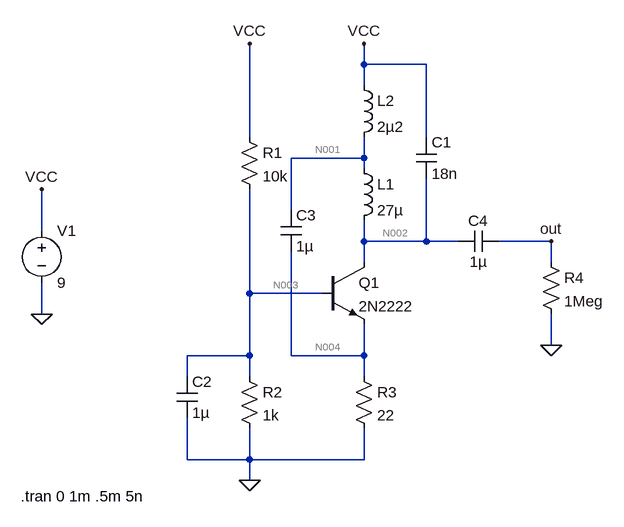
[diagram p0: schematic Perc-5-Hartley.asc]
Perc-5-Hartley.asc, the LTspice schematic file:
Version 4
SHEET 1 880 680
WIRE 288 -112 288 -144
WIRE 384 -112 288 -112
WIRE 288 -80 288 -112
WIRE 112 0 112 -144
WIRE 384 0 384 -112
WIRE 288 32 288 0
WIRE 288 32 176 32
WIRE 288 48 288 32
WIRE 176 112 176 32
WIRE -208 144 -208 80
WIRE 288 160 288 128
WIRE 384 160 384 64
WIRE 384 160 288 160
WIRE 432 160 384 160
WIRE 576 160 496 160
WIRE 288 192 288 160
WIRE 576 192 576 160
WIRE 112 240 112 80
WIRE 224 240 112 240
WIRE -208 272 -208 224
WIRE 576 320 576 272
WIRE 112 336 112 240
WIRE 112 336 16 336
WIRE 176 336 176 176
WIRE 288 336 288 288
WIRE 288 336 176 336
WIRE 16 368 16 336
WIRE 112 368 112 336
WIRE 288 368 288 336
WIRE 16 496 16 432
WIRE 112 496 112 448
WIRE 112 496 16 496
WIRE 288 496 288 448
WIRE 288 496 112 496
WIRE 112 528 112 496
FLAG -208 272 0
FLAG -208 80 VCC
FLAG 112 -144 VCC
FLAG 288 -144 VCC
FLAG 112 528 0
FLAG 576 320 0
FLAG 576 160 out
SYMBOL npn 224 192 R0
SYMATTR InstName Q1
SYMATTR Value 2N2222
SYMBOL res 96 -16 R0
SYMATTR InstName R1
SYMATTR Value 10k
SYMBOL res 96 352 R0
SYMATTR InstName R2
SYMATTR Value 1k
SYMBOL ind 272 32 R0
SYMATTR InstName L1
SYMATTR Value 27µ
SYMBOL ind 272 -96 R0
SYMATTR InstName L2
SYMATTR Value 2µ2
SYMBOL cap 368 0 R0
SYMATTR InstName C1
SYMATTR Value 18n
SYMBOL res 272 352 R0
SYMATTR InstName R3
SYMATTR Value 22
SYMBOL cap 0 368 R0
SYMATTR InstName C2
SYMATTR Value 1µ
SYMBOL cap 160 112 R0
SYMATTR InstName C3
SYMATTR Value 1µ
SYMBOL voltage -208 128 R0
SYMATTR InstName V1
SYMATTR Value 9
SYMBOL cap 496 144 R90
WINDOW 0 0 32 VBottom 2
WINDOW 3 32 32 VTop 2
SYMATTR InstName C4
SYMATTR Value 1µ
SYMBOL res 560 176 R0
SYMATTR InstName R4
SYMATTR Value 1Meg
TEXT -240 552 Left 2 !.tran 0 1m .5m 5n

The netlist it stands for:
* Perc-5-Hartley.asc
Q1 N002 N003 N004 0 2N2222
R1 VCC N003 10k
R2 N003 0 1k
L1 N001 N002 27µ
L2 VCC N001 2µ2
C1 VCC N002 18n
R3 N004 0 22
C2 N003 0 1µ
C3 N001 N004 1µ
V1 VCC 0 9
C4 out N002 1µ
R4 out 0 1Meg
.model NPN NPN
.model PNP PNP
.lib standard.bjt
.tran 0 1m .5m 5n
.backanno
.end

* Results of the author's LTspice run, read from the files saved beside the schematic
* Operating Point, zero values left out:
*   V(n002) = 9 V
*   V(n003) = 798.2 mV
*   V(n004) = 103.6 mV
*   V(vcc) = 9 V
*   V(n001) = 9 V
*   Ic(Q1) = 4.688 mA
*   Ib(Q1) = 21.98 µA
*   Ie(Q1) = -4.71 mA
*   I(L2) = 4.688 mA
*   I(L1) = 4.688 mA
*   I(R3) = 4.71 mA
*   I(R2) = 798.2 µA
*   I(R1) = 820.2 µA
*   I(V1) = -5.508 mA
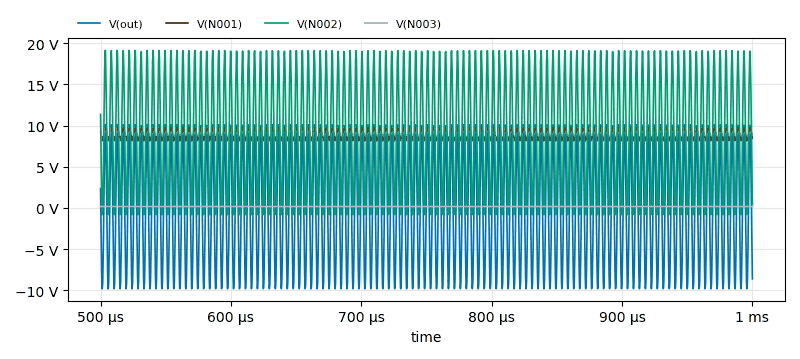
[diagram p1: Transient Analysis of Perc-5-Hartley.asc, plotted from the saved traces]
* Transient Analysis, 1 run:
*   V(out): min -9.812 V, max 10.14 V, average -17.08 mV, rms 7.095 V, last -8.62 V
*   V(N001): min 8.15 V, max 9.761 V, average 8.999 V, rms 9.014 V, last 8.445 V
*   V(N002): min -812.4 mV, max 19.14 V, average 8.983 V, rms 11.45 V, last 380.4 mV
*   V(N003): min 166.3 mV, max 184.6 mV, average 172.5 mV, rms 172.6 mV, last 171.1 mV